# EasyEDA Pro project 穿越机H7飞控工程文件（241123）.epro, schematic h743fc_mainboard_v0.6_fixed

## Sheets
1 MainBoard: Create Date: 2024-03-14; Page Name: MainBoard; Project Name: 穿越机H7飞控; Schematic Name: h743fc_mainboard_v0.6_fixed; Update Date: 2024-05-05; Company: CDUT/个人; Drawed: urmouky; Page Size: A2; Reviewed: urmouky; Version: V0.1
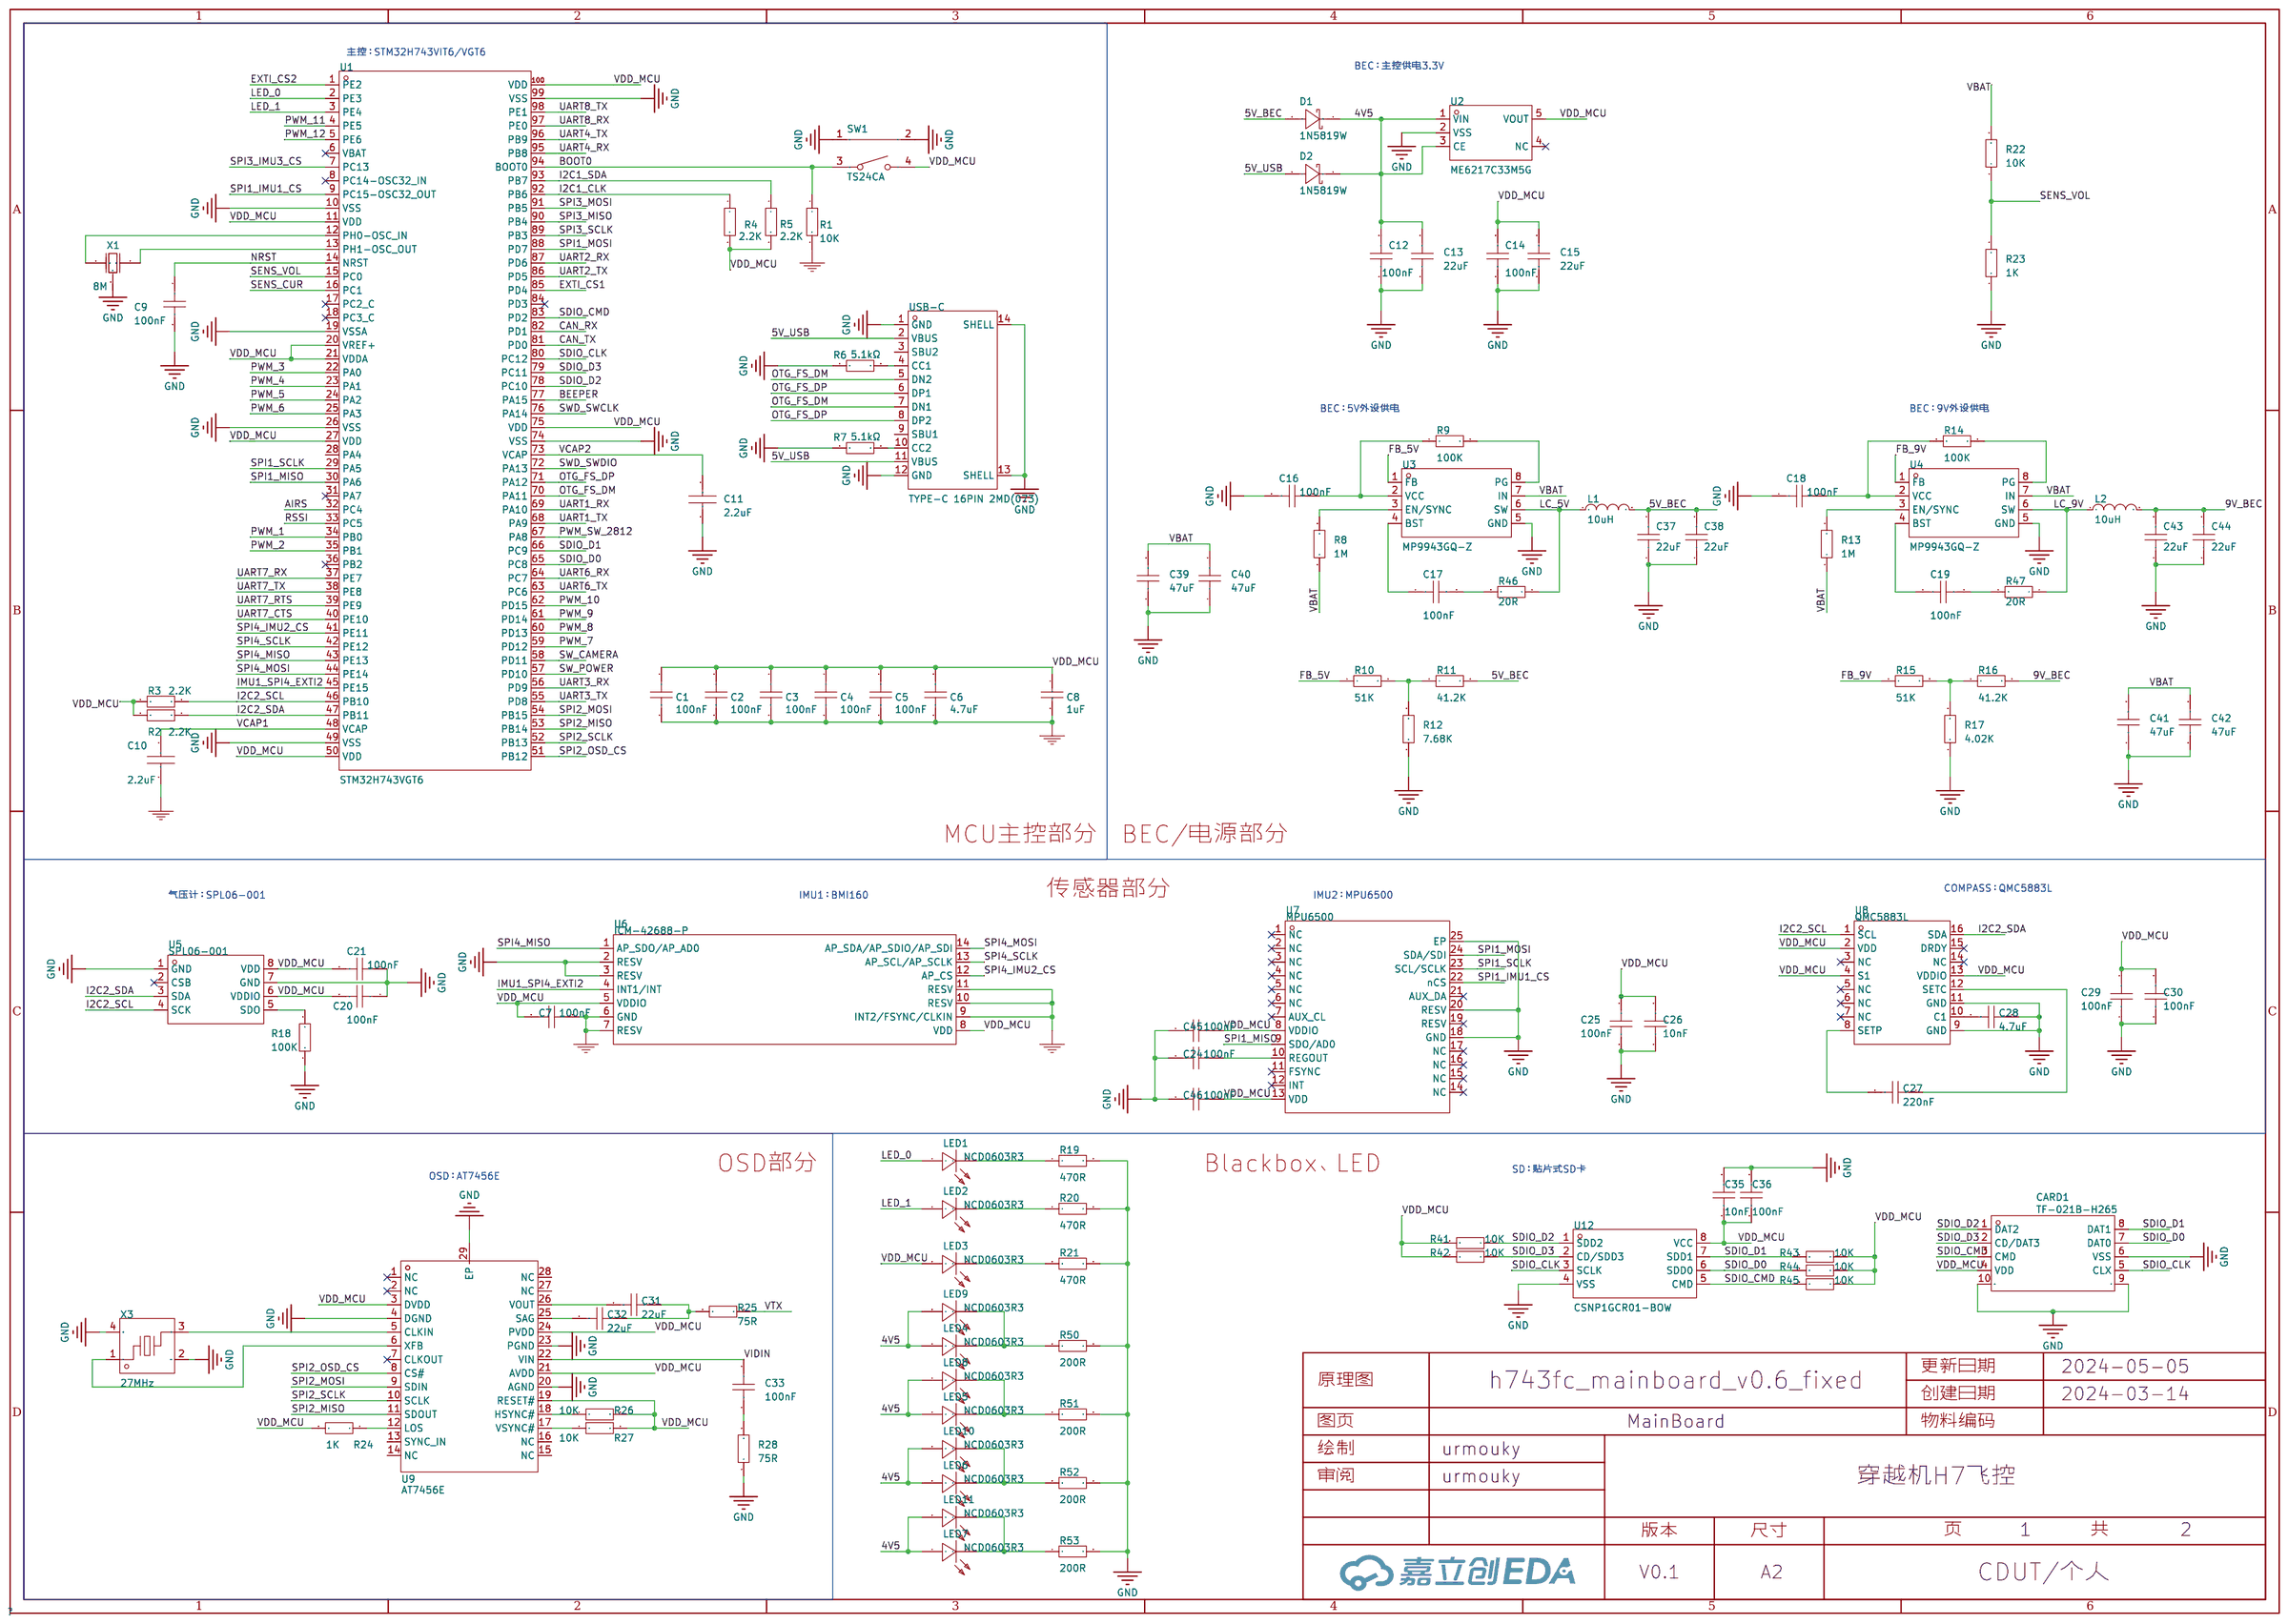
[diagram p7: MainBoard]
2 Pins: Page Name: Pins; Project Name: H7飞控/Betaflight/INAV; Schematic Name: h743fc_mainboard_1; Update Date: 2024-03-15; Company: 嘉立创EDA; Page Size: A4; Version: V0.4
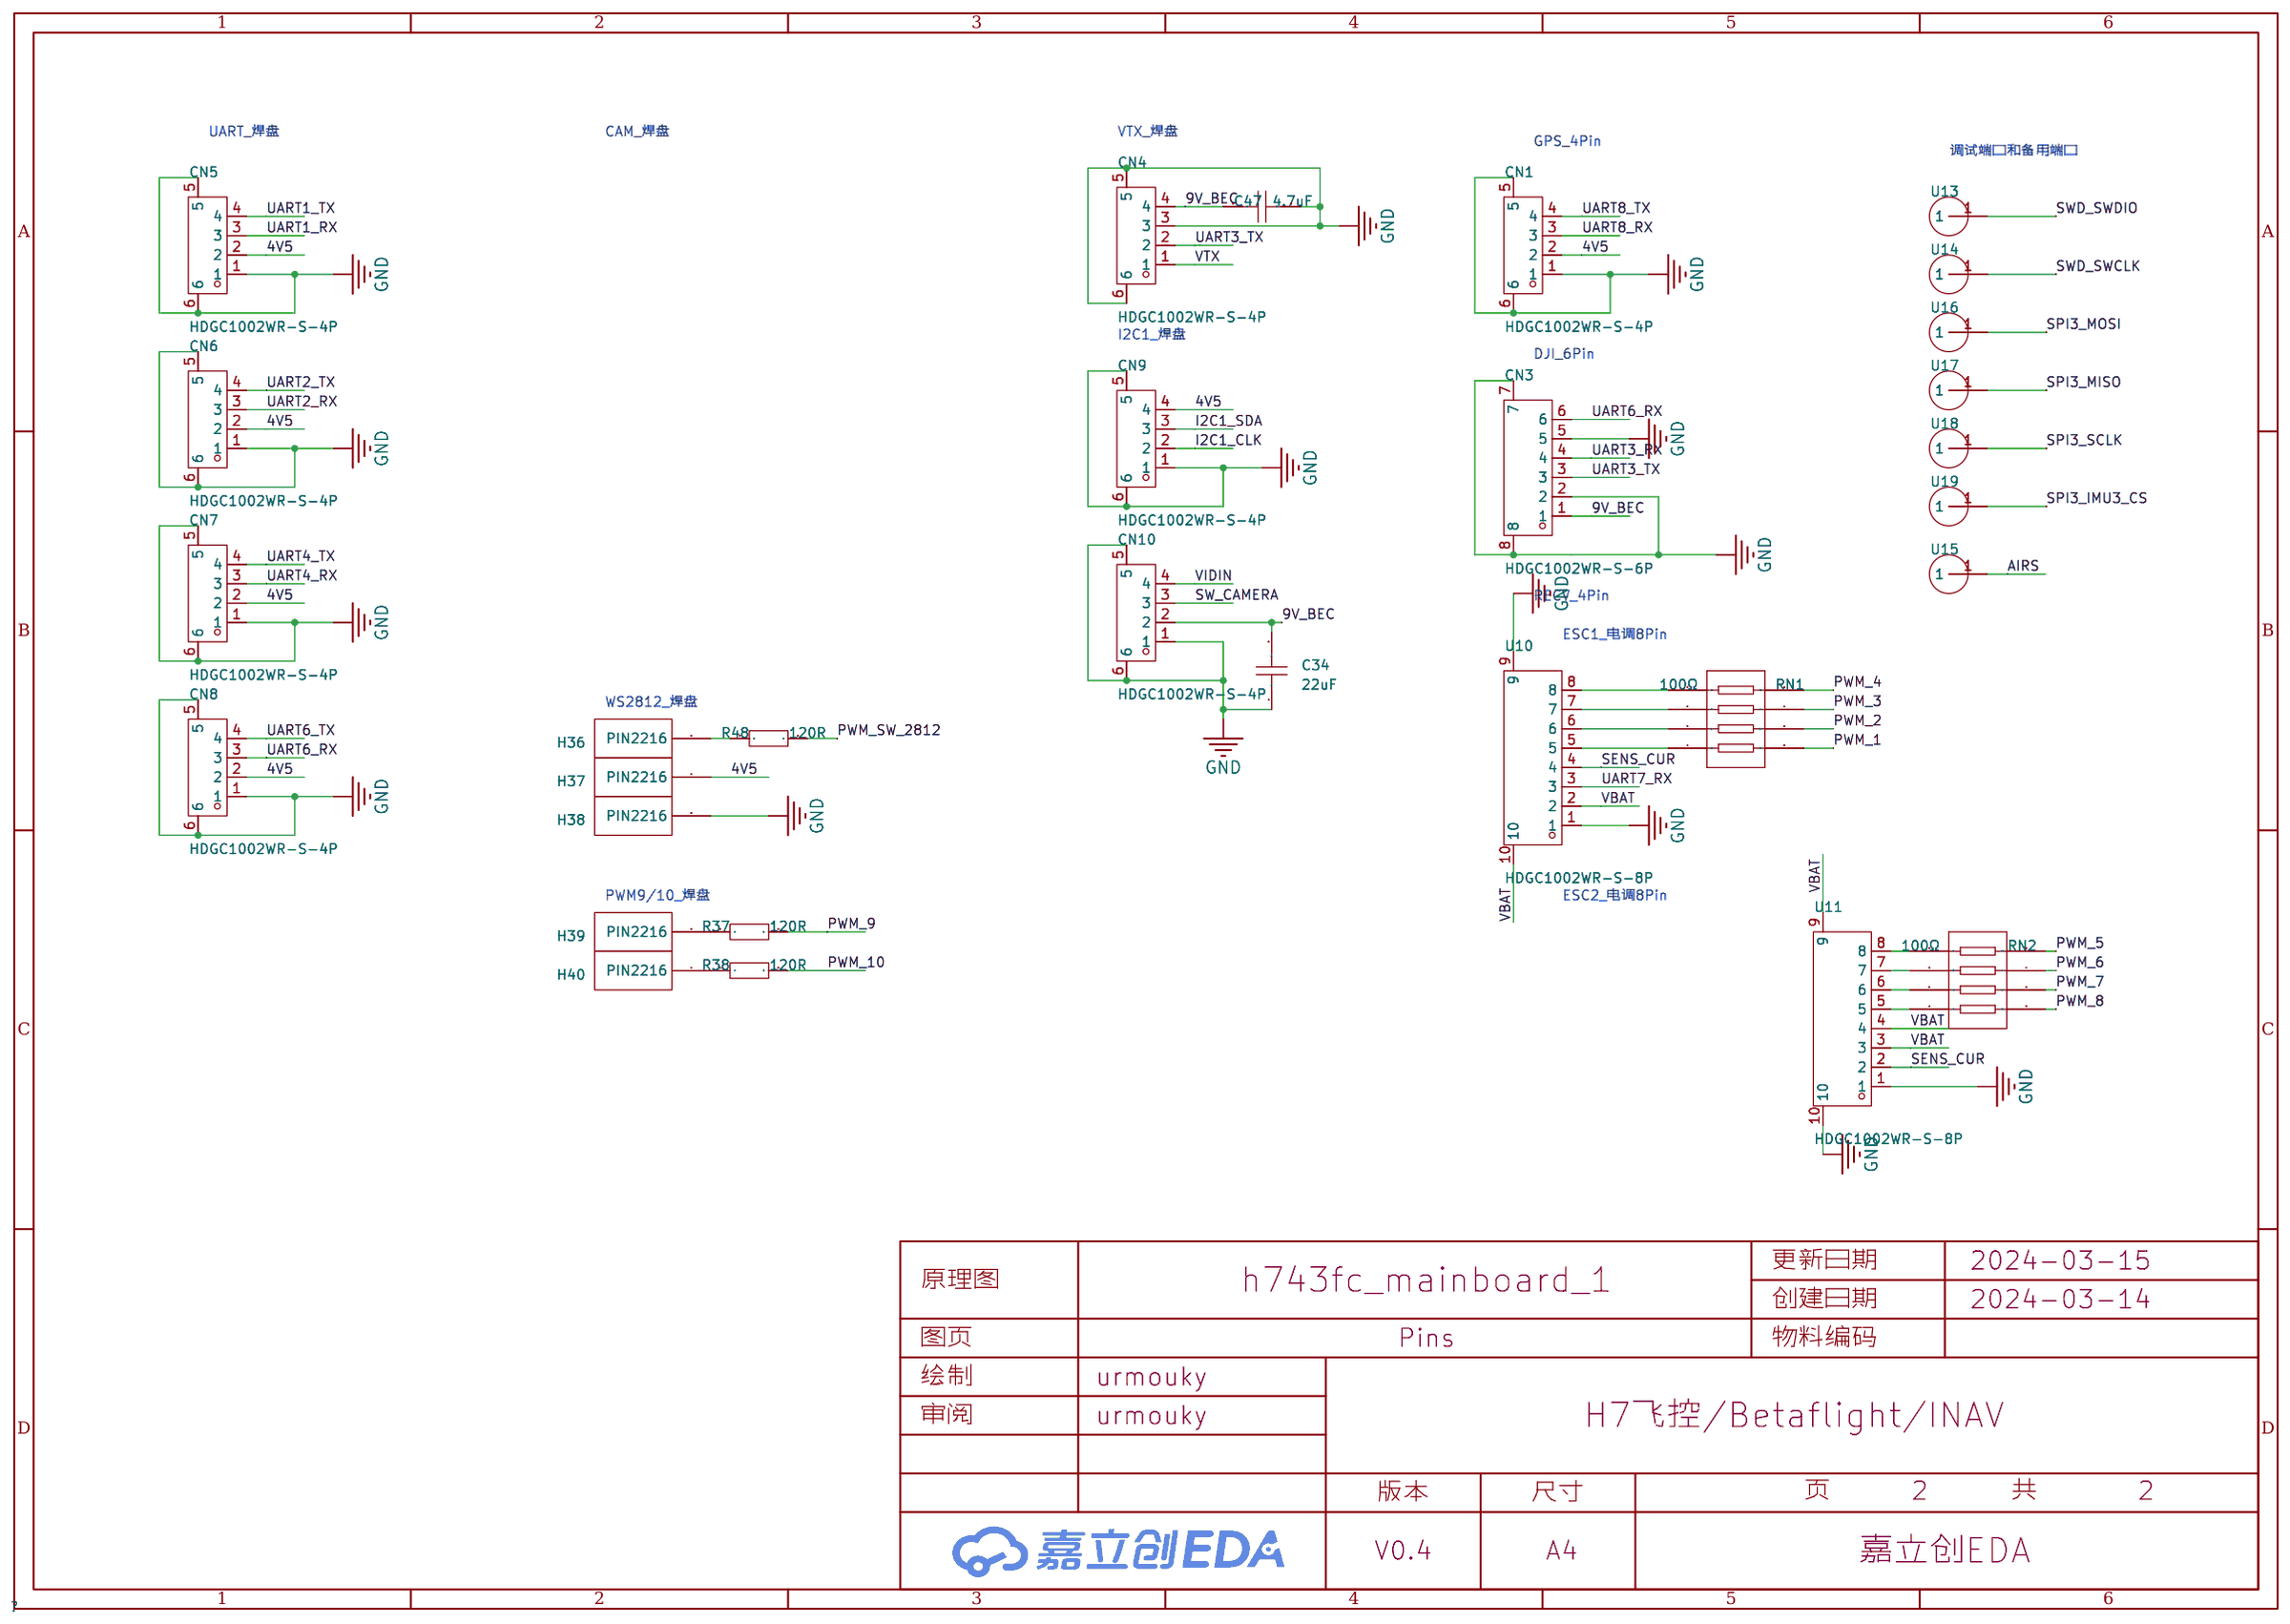
[diagram p8: Pins]

## Parts
sheet MainBoard
C1  100nF  [C0603]
C2  100nF  [C0603]
C3  100nF  [C0603]
C4  100nF  [C0603]
C5  100nF  [C0603]
C6  4.7uF  [C0603]
C7  100nF  [C0603]
C8  1uF  [C0603]
C9  100nF  [C0603]
C10  2.2uF  [C0603]
C11  2.2uF  [C0603]
C12  100nF  [C0603]
C13  22uF  [C0603]
C14  100nF  [C0603]
C15  22uF  [C0603]
C16  100nF  [C0603]
C17  100nF  [C0603]
C18  100nF  [C0603]
C19  100nF  [C0603]
C20  100nF  [C0603]
C21  100nF  [C0603]
C24  100nF  [C0603]
C25  100nF  [C0603]
C26  10nF  [C0603]
C27  220nF  [C0603]
C28  4.7uF  [C0603]
C29  100nF  [C0603]
C30  100nF  [C0603]
C31  22uF  [C0603]
C32  22uF  [C0603]
C33  100nF  [C0603]
C35  10nF  [C0603]
C36  100nF  [C0603]
C37  22uF  [C0603]
C38  22uF  [C0603]
C39  47uF  [C1206]
C40  47uF  [C1206]
C41  47uF  [C1206]
C42  47uF  [C1206]
C43  22uF  [C0603]
C44  22uF  [C0603]
C45  100nF  [C0603]
C46  100nF  [C0603]
CARD1  TF-021B-H265  [TF-SMD_TF-021B-H265]
D1  1N5819W  [SOD-123_L2.8-W1.8-LS3.7-RD]
D2  1N5819W  [SOD-123_L2.8-W1.8-LS3.7-RD]
L1  10uH  [IND-SMD_L4.4-W4.2]
L2  10uH  [IND-SMD_L4.4-W4.2]
LED1  NCD0603R3  [LED0603-R-RD_RED]
LED2  NCD0603R3  [LED0603-R-RD_RED]
LED3  NCD0603R3  [LED0603-R-RD_RED]
LED4  NCD0603R3  [LED0603-R-RD_RED]
LED5  NCD0603R3  [LED0603-R-RD_RED]
LED6  NCD0603R3  [LED0603-R-RD_RED]
LED7  NCD0603R3  [LED0603-R-RD_RED]
LED8  NCD0603R3  [LED0603-R-RD_RED]
LED9  NCD0603R3  [LED0603-R-RD_RED]
LED10  NCD0603R3  [LED0603-R-RD_RED]
LED11  NCD0603R3  [LED0603-R-RD_RED]
R1  10K  [R0603]
R2  2.2K  [R0603]
R3  2.2K  [R0603]
R4  2.2K  [R0603]
R5  2.2K  [R0603]
R6  5.1kΩ  [R0603]
R7  5.1kΩ  [R0603]
R8  1M  [R0603]
R9  100K  [R0603]
R10  51K  [R0603]
R11  41.2K  [R0603]
R12  7.68K  [R0603]
R13  1M  [R0603]
R14  100K  [R0603]
R15  51K  [R0603]
R16  41.2K  [R0603]
R17  4.02K  [R0603]
R18  100K  [R0603]
R19  470R  [R0603]
R20  470R  [R0603]
R21  470R  [R0603]
R22  10K  [R0603]
R23  1K  [R0603]
R24  1K  [R0603]
R25  75R  [R0603]
R26  10K  [R0603]
R27  10K  [R0603]
R28  75R  [R0603]
R41  10K  [R0603]
R42  10K  [R0603]
R43  10K  [R0603]
R44  10K  [R0603]
R45  10K  [R0603]
R46  20R  [R0603]
R47  20R  [R0603]
R50  200R  [R0603]
R51  200R  [R0603]
R52  200R  [R0603]
R53  200R  [R0603]
SW1  TS24CA  [SW-SMD_TS24CA]
U1  STM32H743VGT6  [LQFP-100_L14.0-W14.0-P0.50-LS16.0-BL]
U2  ME6217C33M5G  [SOT-23-5_L3.0-W1.7-P0.95-LS2.8-BR]
U3  MP9943GQ-Z  [QFN-8_L3.0-W3.0-P0.65-BL]
U4  MP9943GQ-Z  [QFN-8_L3.0-W3.0-P0.65-BL]
U5  SPL06-001  [SENSOR-SMD_SPL06-001]
U6  ICM-42688-P  [LGA-14_L3.0-W2.5-P0.50-TL]
U7  MPU6500  [QFN-24_L3.0-W3.0-P0.40-BL-EP]
U8  QMC5883L  [LGA-16_L3.0-W3.0-P0.50-BL_SQ]
U9  AT7456E  [TSSOP-28_L9.7-W4.4-P0.65-LS6.4-BL-EP-2]
U12  CSNP1GCR01-BOW  [LGA-8_L6.0-W8.0-P1.27-TL]
USB-C  TYPE-C 16PIN 2MD(073)  [USB-C-SMD_TYPE-C-6PIN-2MD-073]
X1  8M  [OSC-SMD_3P-L3.2-W1.3-P1.20-L]
X3  27MHz  [CRYSTAL-SMD_4P-L2.0-W1.6-BL]
sheet Pins
C34  22uF  [C0805]
C47  4.7uF  [C0603]
CN1  HDGC1002WR-S-4P  [CONN-SMD_4P-P1.00_HDGC_HDGC1002WR-S-4P]
CN3  HDGC1002WR-S-6P  [CONN-SMD_6P-P1.00_HDGC1002WR-S-6P]
CN4  HDGC1002WR-S-4P  [CONN-SMD_4P-P1.00_HDGC_HDGC1002WR-S-4P]
CN5  HDGC1002WR-S-4P  [CONN-SMD_4P-P1.00_HDGC_HDGC1002WR-S-4P]
CN6  HDGC1002WR-S-4P  [CONN-SMD_4P-P1.00_HDGC_HDGC1002WR-S-4P]
CN7  HDGC1002WR-S-4P  [CONN-SMD_4P-P1.00_HDGC_HDGC1002WR-S-4P]
CN8  HDGC1002WR-S-4P  [CONN-SMD_4P-P1.00_HDGC_HDGC1002WR-S-4P]
CN9  HDGC1002WR-S-4P  [CONN-SMD_4P-P1.00_HDGC_HDGC1002WR-S-4P]
CN10  HDGC1002WR-S-4P  [CONN-SMD_4P-P1.00_HDGC_HDGC1002WR-S-4P]
H36  -  [焊盘1.6*2.2mm]  (no BOM)
H37  -  [焊盘1.6*2.2mm]  (no BOM)
H38  -  [焊盘1.6*2.2mm]  (no BOM)
H39  -  [焊盘1.6*2.2mm]  (no BOM)
H40  -  [焊盘1.6*2.2mm]  (no BOM)
R37  120R  [R0603]
R38  120R  [R0603]
R48  120R  [R0603]
RN1  100Ω  [RES-ARRAY-SMD_0603-8P-L3.2-W1.6-BL]
RN2  100Ω  [RES-ARRAY-SMD_0603-8P-L3.2-W1.6-BL]
U10  HDGC1002WR-S-8P  [CONN-SMD_8P-P1.00_HDGC_HDGC1002WR-S-8P]
U11  HDGC1002WR-S-8P  [CONN-SMD_8P-P1.00_HDGC_HDGC1002WR-S-8P]
U13  -  [焊盘_圆——Debug]
U14  -  [焊盘_圆——Debug]
U15  -  [焊盘_圆——Debug]
U16  -  [焊盘_圆——Debug]
U17  -  [焊盘_圆——Debug]
U18  -  [焊盘_圆——Debug]
U19  -  [焊盘_圆——Debug]

## Library data of the parts
C1-C5 C7 C9 C45 C46 = 100nF: link: https://item.szlcsc.com/15869.html; 3DModel: C0402_L1.0-W0.5-H0.5; Supplier: LCSC; Manufacturer: YAGEO; Manufacturer Part: CC0402KRX7R7BB104; Supplier Part: C60474; JLCPCB Part Class: Extended Part
C6 = 4.7uF: link: https://item.szlcsc.com/15869.html; 3DModel: C0402_L1.0-W0.5-H0.5; Supplier: LCSC; Supplier Part: C307423; Manufacturer: Samsung Electro-Mechanics; Manufacturer Part: CL05A475MQ5NRNC; JLCPCB Part Class: Extended Part
C8 = 1uF: link: https://item.szlcsc.com/15869.html; 3DModel: C0402_L1.0-W0.5-H0.5; Supplier: LCSC; Manufacturer Part: CL05A105KP5NNNC; Manufacturer: SAMSUNG; Supplier Part: C14445; JLCPCB Part Class: Extended Part
C10 C11 = 2.2uF: link: https://item.szlcsc.com/15869.html; 3DModel: C0402_L1.0-W0.5-H0.5; Supplier: LCSC; Manufacturer Part: CL05A225MQ5NSNC; Manufacturer: SAMSUNG; Supplier Part: C12530; JLCPCB Part Class: Basic Part
C12-C21 C24-C33 C35-C38 C43 C44 C47 = CAP_0603: Supplier Footprint: 0603
C39-C42 = CL31A476MPHNNNE: 容值:47uF;精度:±20%;额定电压:10V;材质(温度系数):X5R;; LCSC Part Name: 47uF ±20% 10V; Supplier Part: C96123; Manufacturer: SAMSUNG(三星); Supplier Footprint: 1206; JLCPCB Part Class: Basic Part; Datasheet: https://atta.szlcsc.com/upload/public/pdf/source/20170228/1488267692219.pdf; Supplier: LCSC; Tolerance: ±20%; Voltage Rated: 10V; Temperature Coefficient: X5R
CARD1 = TF-021B-H265: link: https://item.szlcsc.com/510272.html; Supplier: LCSC; Supplier Part: C498185; Manufacturer: SOFNG; JLCPCB Part Class: Extended Part
D1 D2 = 1N5819W_C727115: Supplier Part: C727115; Manufacturer: TWGMC(台湾迪嘉); Supplier Footprint: SOD-123; JLCPCB Part Class: 扩展库; Datasheet: https://atta.szlcsc.com/upload/public/pdf/source/20200828/C727113_260B72EC53C389C21DF1E8AB243F1BFC.pdf; Supplier: LCSC
L1 L2 = FXL0420-100-M: 电感值:10uH;精度:±20%;额定电流:1.6A;饱和电流(Isat):2.2A;类型:一体成型电感;; LCSC Part Name: 10uH ±20% 2.2A; Supplier Part: C177242; Manufacturer: cjiang(长江微电); Supplier Footprint: SMD,4.2x4.4mm; JLCPCB Part Class: Extended Part; Datasheet: https://atta.szlcsc.com/upload/public/pdf/source/20200117/C485363_A2440626DC7482D75DD0DD56D1883FBF.pdf; Supplier: LCSC; Tolerance: ±20%; Rated Current: 1.6A; Saturation Current (Isat): 2.2A; DC Resistance (DCR): 282mΩ; Type: 一体成型电感
LED1-LED11 = NCD0603R3: 尺寸1.6x0.8x0.8；IF=20ma：1.6~2.6v，620~640nm,51~150mcd金线，光强高，功耗低，可靠性好，寿命长; LCSC Part Name: 红色;贴片LED;0603红灯;; Supplier Part: C3151730; Manufacturer: 国星光电; Supplier Footprint: 0603; JLCPCB Part Class: 扩展库; Datasheet: https://atta.szlcsc.com/upload/public/pdf/source/20220704/CBFF28C1847A97213A75929E60B7DDE7.pdf; Supplier: LCSC
R1-R5 = 10K: link: https://item.szlcsc.com/323315.html; 3DModel: R0402_L1.0-W0.5-H0.5; Supplier: LCSC; Manufacturer: YAGEO; Manufacturer Part: RC0402FR-0710KL; Supplier Part: C60490; JLCPCB Part Class: Extended Part; Resistance: 10kΩ
R6 R7 = 5.1kΩ: link: https://item.szlcsc.com/323315.html; 3DModel: R0402_L1.0-W0.5-H0.5; Supplier: LCSC; Manufacturer: UniOhm; Manufacturer Part: 0402WGJ0512TCE; Supplier Part: C25941; Resistance: 5.1K; JLCPCB Part Class: Extended Part
R8-R28 R37 R38 R41-R48 R50-R53 = Res_0603: Supplier Footprint: 0603
SW1 = TS24CA: 触点电流:50mA;额定电压(DC):12V;电路结构:单刀单掷;安装方式:卧贴;带灯:-;机械寿命:-;; LCSC Part Name: 4.55*1.8*3.5mm 卧贴 轻触开关; Supplier Part: C393942; Manufacturer: SHOU HAN(首韩); Supplier Footprint: SMD; JLCPCB Part Class: 扩展库; Datasheet: https://atta.szlcsc.com/upload/public/pdf/source/20190521/C393942_591A9E318887EFA4274D34029981AD99.pdf; Supplier: LCSC; Contact Current: 50mA; Voltage Rating (DC): 12V; Circuit: 单刀单掷; Mounting Style: 卧贴; Actuator Style: 矩形按钮; Switch Length: 4.55mm; Switch Width: 1.8mm; Switch Height: 3.5mm
U1 = STM32H743VGT6: Supplier Part: C730183; Manufacturer: ST(意法半导体); Supplier Footprint: LQFP-100(14x14); JLCPCB Part Class: 扩展库; Datasheet: https://atta.szlcsc.com/upload/public/pdf/source/20200508/C529058_DA70143F266D6D825C3A912656F12A87.pdf; Supplier: LCSC
U2 = ME6217C33M5G: 输出类型:固定;输出极性:正;最大输入电压:7V;输出电压:3.3V;输出电流:800mA;电源纹波抑制比(PSRR):65dB@(1kHz);; Supplier Part: C427602; Manufacturer: MICRONE(南京微盟); Supplier Footprint: SOT-23-5; JLCPCB Part Class: 扩展库; Datasheet: https://atta.szlcsc.com/upload/public/pdf/source/20190910/C427602_D4B9162A2E9D9EF57C60010DFDECEF37.pdf; Supplier: LCSC; Output Type: 固定; Output Polarity: 正; Number of Outputs: 1; Maximum Input Voltage: 7V; Output Voltage: 3.3V; Dropout Voltage: 180mV@(300mA); Output Current: 800mA; Power Supply Rejection Ratio (PSRR): 65dB@(1kHz)
U3 U4 = MP9943GQ-Z: Supplier Part: C477821; Supplier Footprint: QFN-8_3x3mm; JLCPCB Part Class: 扩展库; Datasheet: 2021-05-22/374398S/94eb60b6438e46f987ac1f72df989e4b/MP9943.pdf; Supplier: LCSC
U5 = SPL06-001_C2684428: LCSC Part Name: 普通气压传感器; Supplier Part: C2684428; Manufacturer: Goertek(歌尔); Supplier Footprint: SMD-8P,2x2.5mm; JLCPCB Part Class: 扩展库; Datasheet: https://atta.szlcsc.com/upload/public/pdf/source/20210120/C2684428_7EA58BBCA3793458F617124FBE4BF8F1.pdf; Supplier: LCSC
U6 = ICM-42688-P: link: https://lcsc.com/product-detail/Sensors_Bosch_BMG250_BMG250_C189521.html; 3DModel: LGA-14_L2.5-W3.0-H0.9-P0.50; Supplier: LCSC; Supplier Part: C1850418; Manufacturer: InvenSense; JLCPCB Part Class: Extended Part
U7 = MPU6500: Accelerometer, Gyroscope, 3 Axis Sensor I2C, SPI Output; Supplier Part: C50278; Manufacturer: TDK InvenSense(应美盛); Supplier Footprint: QFN-24-EP(3x3); JLCPCB Part Class: 扩展库; Datasheet: https://atta.szlcsc.com/upload/public/pdf/source/20170505/1493957890595.pdf; Supplier: LCSC
U8 = QMC5883L: LCSC Part Name: 三轴磁传感器; Supplier Part: C976032; Manufacturer: QST(上海矽睿); Supplier Footprint: LGA-16(3x3x0.9); JLCPCB Part Class: 扩展库; Datasheet: https://atta.szlcsc.com/upload/public/pdf/source/20201217/C976032_5B9A2F3901E175046CBA037B1F18A1F2.pdf; Supplier: LCSC
U9 = AT7456E: 视频字符叠加芯片，跟MAX7456-pin-pin; Supplier Part: C82351; Manufacturer: 杭州中科微; Supplier Footprint: TSSOP-28; JLCPCB Part Class: 扩展库; Datasheet: https://atta.szlcsc.com/upload/public/pdf/source/20180326/C82351_A40539A53E8345C88178541014FDE5FB.pdf; Supplier: LCSC
U12 = CSNP1GCR01-BOW: 免驱动使用，标准SDIO接口，兼容SPI/SD/eMMC接口，兼容各大MCU平台;内置EDC/ECC，坏块管理，垃圾回收算法;可机贴，锁定晶圆和控制器,一致性高；内置SLC晶圆,10W次擦写寿命，通过1万次随机掉电测试，支持工业级温度-40°~+85°。 CS(创世) SD NAND也被很多开发者朋友称为：贴片式TF卡，贴片式SD卡，贴片卡，焊接式SD卡，焊接式TF卡，工业级TF卡，工业级SD卡，嵌入式SD卡等。主要解决了主控(比如STM32系列的MCU单片机 )使用 SLC NAND FLASH,SPI; LCSC Part Name: 1Gb SD NAND 一代 SD NAND 一代; Supplier Part: C2691593; Manufacturer: CS(创世); Supplier Footprint: LGA-8(6x8); JLCPCB Part Class: 扩展库; Datasheet: https://atta.szlcsc.com/upload/public/pdf/source/20210222/C2691593_195F15B6690BC3EBF1684FE727FBFF20.pdf; Supplier: LCSC
USB-C = TYPE-C 16PIN 2MD(073): 连接器类型:Type-C;标准:-;公母:母座;触点数量:16;端口数量:1;安装方式:卧贴;额定电流 - 电源:5A;工作温度范围:-25℃~+85℃;; LCSC Part Name: TYPE-C母座 16P 4脚插件带定位柱 不锈钢外壳 2次模顶; Supplier Part: C2765186; Manufacturer: SHOU HAN(首韩); Supplier Footprint: SMD; JLCPCB Part Class: 扩展库; Supplier: LCSC; Connector Type: Type-C; Gender: 母座; Number of Contacts: 16; Number of Ports: 1; Mounting Style: 卧贴; Current Rating - Power (Max): 5A; Operating Temperature Range: -25℃~+85℃
X1 = CSTNE8M00GH5C000R0: LCSC Part Name: 8MHz ±0.07% 33pF; Supplier Part: C341525; Manufacturer: muRata(村田); Supplier Footprint: SMD; JLCPCB Part Class: 扩展库; Datasheet: https://atta.szlcsc.com/upload/public/pdf/source/20181211/C341525_832BA077079E4863A5153C1DB98581D5.pdf; Supplier: LCSC
X3 = XL7EL89COI-111YLC-27M: 频率:27MHz;常温频差:±10ppm;外接负载电容:12pF;; LCSC Part Name: 27MHz ±10ppm 12pF; Supplier Part: C18214311; Manufacturer: YXC(扬兴晶振); Supplier Footprint: SMD2016-4P; Datasheet: https://atta.szlcsc.com/upload/public/pdf/source/20231010/DAC90943B3B8A4FBC65AA4F83497DCE2.pdf; Supplier: LCSC; Normal temperature Frequency Tolerance: ±10ppm; External load capacitor: 12pF; Operating Temperature: -40℃~+85℃
C34 = CAP0805: Origin Footprint 2: 0805C; Supplier Footprint: 0603
CN1 CN4-CN10 = HDGC1002WR-S-4P: SH1.0针座卧贴 4P; LCSC Part Name: SH1.0针座卧贴 4P; Supplier Part: C2936214; Manufacturer: HDGC(华德共创); Supplier Footprint: SMD,P=1mm; JLCPCB Part Class: 扩展库; Datasheet: https://atta.szlcsc.com/upload/public/pdf/source/20211229/E8A09E85670B5E97244D2008A24D97FE.pdf; Supplier: LCSC
CN3 = HDGC1002WR-S-6P: 参考系列:SH;间距:1mm;排数:1;每排PIN数:6;公母:公型插针;安装方式:卧贴;额定电流:1A;工作温度范围:-40℃~+85℃;; LCSC Part Name: SH 1mm 卧贴; Supplier Part: C3041141; Manufacturer: HDGC(华德共创); Supplier Footprint: SMD,P=1mm; JLCPCB Part Class: 扩展库; Datasheet: https://atta.szlcsc.com/upload/public/pdf/source/20220621/C2AA6A1A2A279F73FC0521BA202CB6E2.pdf; Supplier: LCSC; Reference Series: SH; Pitch: 1mm; Number of Rows: 1; Number of PINs Per Row: 6; Gender: 公型插针; Mounting Style: 卧贴; Current Rating (Max): 1A; Operating Temperature Range: -40℃~+85℃
H36-H40 = 焊盘1.6x2.2: 焊盘：1.6mm*2.2mm
RN1 RN2 = 4D03WGJ0101T5E: 电阻器数:4;阻值:100Ω;精度:±5%;单个元件功率:62.5mW;温度系数:±200ppm/℃;; LCSC Part Name: 100Ω ±5%; Supplier Part: C25506; Manufacturer: UNI-ROYAL(厚声); Supplier Footprint: 0603x4; JLCPCB Part Class: 扩展库; Datasheet: https://atta.szlcsc.com/upload/public/pdf/source/20191224/C474318_2527498AE30E813171187CCD28401A71.pdf; Supplier: LCSC; Number of Resistors: 4; Tolerance: ±5%; Power(Watts): 62.5mW; Temperature Coefficient: ±200ppm/℃; Number of Pins: 8
U10 U11 = HDGC1002WR-S-8P: 参考系列:SH;间距:1mm;排数:1;每排PIN数:8;公母:公型插针;安装方式:卧贴;额定电流:1A;工作温度范围:-40℃~+85℃;; LCSC Part Name: SH 1mm 卧贴; Supplier Part: C3041142; Manufacturer: HDGC(华德共创); Supplier Footprint: SMD,P=1mm; JLCPCB Part Class: 扩展库; Datasheet: https://atta.szlcsc.com/upload/public/pdf/source/20220621/C2AA6A1A2A279F73FC0521BA202CB6E2.pdf; Supplier: LCSC; Reference Series: SH; Pitch: 1mm; Number of Rows: 1; Number of PINs Per Row: 8; Gender: 公型插针; Mounting Style: 卧贴; Current Rating (Max): 1A; Operating Temperature Range: -40℃~+85℃
U13-U19 = 焊盘_圆_Debug

## Nets
4V5: C12.2 C13.2 CN1.2 CN5.2 CN6.2 CN7.2 CN8.2 CN9.4 D1.1(C) D2.1(C) H37.1(PIN2216) LED4.1(A) LED5.1(A) LED6.1(A) LED7.1(A) LED8.1(A) LED9.1(A) LED10.1(A) LED11.1(A) U2.1(VIN) U2.3(CE)
5V_BEC: C37.2 C38.2 D1.2(A) L1.2 R11.2
5V_USB: D2.2(A) USB-C.2(VBUS) USB-C.11(VBUS)
9V_BEC: C34.2 C43.2 C44.2 C47.1 CN3.1 CN4.4 CN10.2 L2.2 R16.2
GND: C1.2 C2.2 C3.2 C4.2 C5.2 C6.1 C7.2 C8.2 C9.2 C10.2 C11.2 C12.1 C13.1 C14.1 C15.1 C16.1 C18.1 C20.1 C21.1 C24.1 C25.1 C26.1 C28.2 C29.1 C30.1 C34.1 C35.2 C36.2 C37.1 C38.1 C39.1 C40.1 C41.1 C42.1 C43.1 C44.1 C45.2 C46.1 C47.2 CARD1.6(VSS) CARD1.9 CARD1.10 CN1.1 CN1.5 CN1.6 CN3.2 CN3.5 CN3.7 CN3.8 CN4.3 CN4.5 CN4.6 CN5.1 CN5.5 CN5.6 CN6.1 CN6.5 CN6.6 CN7.1 CN7.5 CN7.6 CN8.1 CN8.5 CN8.6 CN9.1 CN9.5 CN9.6 CN10.1 CN10.5 CN10.6 H38.1(PIN2216) R1.2 R6.1 R7.1 R12.1 R17.1 R18.1 R19.2 R20.2 R21.2 R23.1 R28.1 R50.2 R51.2 R52.2 R53.2 SW1.1 SW1.2 U1.10(VSS) U1.19(VSSA) U1.26(VSS) U1.49(VSS) U1.74(VSS) U1.99(VSS) U2.2(VSS) U3.5(GND) U4.5(GND) U5.1(GND) U5.7(GND) U6.2(RESV) U6.3(RESV) U6.6(GND) U6.7(RESV) U6.9(INT2/FSYNC/CLKIN) U6.10(RESV) U6.11(RESV) U7.18(GND) U7.20(RESV) U7.25(EP) U8.9(GND) U8.11(GND) U9.4(DGND) U9.20(AGND) U9.23(PGND) U9.29(EP) U10.1 U10.9 U11.1 U11.10 U12.4(VSS) USB-C.1(GND) USB-C.12(GND) USB-C.13(SHELL) USB-C.14(SHELL) X1.2(GND) X3.2(GND) X3.4(GND)
VBAT: C39.2 C40.2 C41.2 C42.2 R8.1 R13.1 R22.2 U3.7(IN) U4.7(IN) U10.2 U10.10 U11.3 U11.4 U11.9
VDD_MCU: C1.1 C2.1 C3.1 C4.1 C5.1 C6.2 C7.1 C8.1 C14.2 C15.2 C20.2 C21.2 C25.2 C26.2 C29.2 C30.2 C35.1 C36.1 C45.1 C46.2 CARD1.4(VDD) LED3.1(A) R2.1 R3.1 R4.2 R5.2 R24.2 R26.2 R27.2 R41.2 R42.2 R43.1 R44.1 R45.1 SW1.4 U1.11(VDD) U1.20(VREF+) U1.21(VDDA) U1.27(VDD) U1.50(VDD) U1.75(VDD) U1.100(VDD) U2.5(VOUT) U5.6(VDDIO) U5.8(VDD) U6.5(VDDIO) U6.8(VDD) U7.8(VDDIO) U7.13(VDD) U8.2(VDD) U8.4(S1) U8.13(VDDIO) U9.3(DVDD) U9.19(RESET#) U9.21(AVDD) U9.24(PVDD) U12.8(VCC)
AIRS: U1.32(PC4) U15.1
BEEPER: U1.77(PA15)
BOOT0: R1.1 SW1.3 U1.94(BOOT0)
CAN_RX: U1.82(PD1)
CAN_TX: U1.81(PD0)
EXTI_CS1: U1.85(PD4)
EXTI_CS2: U1.1(PE2)
FB_5V: R10.1 U3.1(FB)
FB_9V: R15.1 U4.1(FB)
I2C1_CLK: CN9.2 R4.1 U1.92(PB6)
I2C1_SDA: CN9.3 R5.1 U1.93(PB7)
I2C2_SCL: R3.2 U1.46(PB10) U5.4(SCK) U8.1(SCL)
I2C2_SDA: R2.2 U1.47(PB11) U5.3(SDA) U8.16(SDA)
IMU1_SPI4_EXTI2: U1.45(PE15) U6.4(INT1/INT)
LC_5V: L1.1 R46.1 U3.6(SW)
LC_9V: L2.1 R47.1 U4.6(SW)
LED_0: LED1.1(A) U1.2(PE3)
LED_1: LED2.1(A) U1.3(PE4)
NRST: C9.1 U1.14(NRST)
OTG_FS_DM: U1.70(PA11) USB-C.5(DN2) USB-C.7(DN1)
OTG_FS_DP: U1.71(PA12) USB-C.6(DP1) USB-C.8(DP2)
PWM_1: RN1.5 U1.34(PB0)
PWM_2: RN1.6 U1.35(PB1)
PWM_3: RN1.7 U1.22(PA0)
PWM_4: RN1.8 U1.23(PA1)
PWM_5: RN2.8 U1.24(PA2)
PWM_6: RN2.7 U1.25(PA3)
PWM_7: RN2.6 U1.59(PD12)
PWM_8: RN2.5 U1.60(PD13)
PWM_9: R37.2 U1.61(PD14)
PWM_10: R38.2 U1.62(PD15)
PWM_11: U1.4(PE5)
PWM_12: U1.5(PE6)
PWM_SW_2812: R48.2 U1.67(PA8)
RSSI: U1.33(PC5)
SDIO_CLK: CARD1.5(CLX) U1.80(PC12) U12.3(SCLK)
SDIO_CMD: CARD1.3(CMD) R45.2 U1.83(PD2) U12.5(CMD)
SDIO_D0: CARD1.7(DAT0) R44.2 U1.65(PC8) U12.6(SDD0)
SDIO_D1: CARD1.8(DAT1) R43.2 U1.66(PC9) U12.7(SDD1)
SDIO_D2: CARD1.1(DAT2) R41.1 U1.78(PC10) U12.1(SDD2)
SDIO_D3: CARD1.2(CD/DAT3) R42.1 U1.79(PC11) U12.2(CD/SDD3)
SENS_CUR: U1.16(PC1) U10.4 U11.2
SENS_VOL: R22.1 R23.2 U1.15(PC0)
SPI1_IMU1_CS: U1.9(PC15-OSC32_OUT) U7.22(nCS)
SPI1_MISO: U1.30(PA6) U7.9(SDO/AD0)
SPI1_MOSI: U1.88(PD7) U7.24(SDA/SDI)
SPI1_SCLK: U1.29(PA5) U7.23(SCL/SCLK)
SPI2_MISO: U1.53(PB14) U9.11(SDOUT)
SPI2_MOSI: U1.54(PB15) U9.9(SDIN)
SPI2_OSD_CS: U1.51(PB12) U9.8(CS#)
SPI2_SCLK: U1.52(PB13) U9.10(SCLK)
SPI3_IMU3_CS: U1.7(PC13) U19.1
SPI3_MISO: U1.90(PB4) U17.1
SPI3_MOSI: U1.91(PB5) U16.1
SPI3_SCLK: U1.89(PB3) U18.1
SPI4_IMU2_CS: U1.41(PE11) U6.12(AP_CS)
SPI4_MISO: U1.43(PE13) U6.1(AP_SDO/AP_AD0)
SPI4_MOSI: U1.44(PE14) U6.14(AP_SDA/AP_SDIO/AP_SDI)
SPI4_SCLK: U1.42(PE12) U6.13(AP_SCL/AP_SCLK)
SW_CAMERA: CN10.3 U1.58(PD11)
SW_POWER: U1.57(PD10)
SWD_SWCLK: U1.76(PA14) U14.1
SWD_SWDIO: U1.72(PA13) U13.1
UART1_RX: CN5.3 U1.69(PA10)
UART1_TX: CN5.4 U1.68(PA9)
UART2_RX: CN6.3 U1.87(PD6)
UART2_TX: CN6.4 U1.86(PD5)
UART3_RX: CN3.4 U1.56(PD9)
UART3_TX: CN3.3 CN4.2 U1.55(PD8)
UART4_RX: CN7.3 U1.95(PB8)
UART4_TX: CN7.4 U1.96(PB9)
UART6_RX: CN3.6 CN8.3 U1.64(PC7)
UART6_TX: CN8.4 U1.63(PC6)
UART7_CTS: U1.40(PE10)
UART7_RTS: U1.39(PE9)
UART7_RX: U1.37(PE7) U10.3
UART7_TX: U1.38(PE8)
UART8_RX: CN1.3 U1.97(PE0)
UART8_TX: CN1.4 U1.98(PE1)
VCAP1: C10.1 U1.48(VCAP)
VCAP2: C11.1 U1.73(VCAP)
VIDIN: C33.2 CN10.4 U9.22(VIN)
VTX: CN4.1 R25.2
$1N2867: U1.12(PH0-OSC_IN) X1.3(OSC2)
$1N2871: U1.13(PH1-OSC_OUT) X1.1(OSC1)
$1N3300: R7.2 USB-C.10(CC2)
$1N3472: R6.2 USB-C.4(CC1)
$1N5215: R8.2 U3.3(EN/SYNC)
$1N5401: C17.1 U3.4(BST)
$1N5477: C16.2 R9.1 U3.2(VCC)
$1N5478: R9.2 U3.8(PG)
$1N5616: R10.2 R11.1 R12.2
$1N5946: R13.2 U4.3(EN/SYNC)
$1N5955: C19.1 U4.4(BST)
$1N5966: C18.2 R14.1 U4.2(VCC)
$1N5971: R14.2 U4.8(PG)
$1N5978: R15.2 R16.1 R17.2
$1N6188: R18.2 U5.5(SDO)
$1N7216: C24.2 U7.10(REGOUT)
$1N7601: C27.2 U8.8(SETP)
$1N7606: C27.1 U8.12(SETC)
$1N7687: C28.1 U8.10(C1)
$1N8096: LED1.2(K) R19.1
$1N8099: LED2.2(K) R20.1
$1N8102: LED3.2(K) R21.1
$1N8750: U9.5(CLKIN) X3.3
$1N8757: U9.6(XFB) X3.1
$1N8872: R24.1 U9.12(LOS)
$1N10347: C31.1 U9.26(VOUT)
$1N10350: C32.1 U9.25(SAG)
$1N10453: C31.2 C32.2 R25.1
$1N10536: R26.1 U9.18(HSYNC#)
$1N10539: R27.1 U9.17(VSYNC#)
$1N10759: C33.1 R28.2
$1N44323: C17.2 R46.2
$1N44357: C19.2 R47.2
$1N51671: LED7.2(K) LED11.2(K) R53.1
$1N51680: LED6.2(K) LED10.2(K) R52.1
$1N51711: LED5.2(K) LED8.2(K) R51.1
$1N51732: LED4.2(K) LED9.2(K) R50.1
$2N3208: H39.1(PIN2216) R37.1
$2N3210: H40.1(PIN2216) R38.1
$2N11416: H36.1(PIN2216) R48.1
$2N14999: RN2.1 U11.8
$2N15001: RN2.2 U11.7
$2N15003: RN2.3 U11.6
$2N15005: RN2.4 U11.5
$2N15034: RN1.1 U10.8
$2N15036: RN1.2 U10.7
$2N15038: RN1.3 U10.6
$2N15040: RN1.4 U10.5

Not connected (* = marked no-connect by the designer): U1 6(VBAT)* 8(PC14-OSC32_IN)* 17(PC2_C)* 18(PC3_C)* 28(PA4) 31(PA7)* 36(PB2)* 84(PD3)*; U2 4(NC)*; U5 2(CSB)*; U7 1(NC)* 2(NC)* 3(NC)* 4(NC)* 5(NC)* 6(NC)* 7(AUX_CL)* 11(FSYNC)* 12(INT)* 14(NC)* 15(NC)* 16(NC)* 17(NC)* 19(RESV)* 21(AUX_DA)*; U8 3(NC)* 5(NC)* 6(NC)* 7(NC)* 14(NC)* 15(DRDY)*; U9 1(NC)* 2(NC)* 7(CLKOUT)* 13(SYNC_IN) 14(NC) 15(NC) 16(NC) 27(NC) 28(NC); USB-C 3(SBU2) 9(SBU1)

## Notes on the sheets
sheet 1
- 主控：STM32H743VIT6/VGT6
- BEC：主控供电3.3V
- BEC：5V外设供电
- BEC：9V外设供电
- MCU主控部分
- BEC/电源部分
- 气压计：SPL06-001
- IMU1：BMI160
- 传感器部分
- IMU2：MPU6500
- COMPASS：QMC5883L
- OSD：AT7456E
- OSD部分
- Blackbox、LED
- SD：贴片式SD卡
sheet 2
- UART_焊盘
- CAM_焊盘
- VTX_焊盘
- GPS_4Pin
- 调试端口和备用端口
- I2C1_焊盘
- DJI_6Pin
- RECV_4Pin
- ESC1_电调8Pin
- WS2812_焊盘
- PWM9/10_焊盘
- ESC2_电调8Pin
